# Altium schematic sheet handheld_circuits.SchDoc: DE:HANDHELD
size 139 x 96 mm; SheetNumber: 1; SheetTotal: 2; WebFGR: www.abebashop.com; VersionFGR: 20220726; PageSetup: Record=PageOptions|CenterHorizontal=True|CenterVertical=True|PrintScale=2.09|XCorrection=1.00|YCorrection=1.00|PrintKind=0|BorderSize=5000000|LeftOffset=0|BottomOffset=0|Orientation=2|PaperLength=1000|PaperWidth=1000|Scale=100|PaperSource=7|PrintQuality=-4|MediaType=1|DitherType=10|PaperKind=A4|PrintScaleMode=1
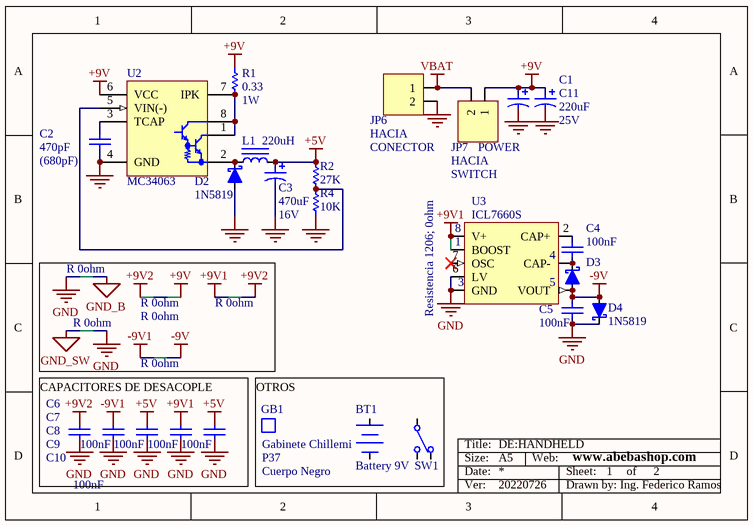
[diagram p0: handheld_circuits.SchDoc]

## Parts
BT1  Battery 9V  [BAT_9V]
C1  Cap Pol  [C_EL_8X11-5]  (value not drawn)
C2  value 470pF  Technology: (680pF)  [c1206]  (hidden comment: Cap)
C3  value 470uF  Voltaje: 16V  [C_EL_6-3X11]  (hidden comment: Cap Pol)
C4  value 100nF  [c1206]  (hidden comment: Cap)
C5  value 100nF  [c1206]  (hidden comment: Cap)
C6  value 100nF  [c1206]  (hidden comment: Cap)
C7  value 100nF  [c1206]  (hidden comment: Cap)
C8  value 100nF  [c1206]  (hidden comment: Cap)
C9  value 100nF  [c1206]  (hidden comment: Cap)
C10  value 100nF  [c1206]  (hidden comment: Cap)
C11  value 220uF  Voltaje: 25V  [C_EL_8X11-5]  (hidden comment: Cap Pol)
D2  1N5819  [d_do41]
D3  1N5819  [d_do41]  (value not drawn)
D4  1N5819  [d_do41]
GB1  Gabinete Chillemi  Codigo Chillemi: P37  Dolares Chillemi: Cuerpo Negro  [PLA_GAB_HAND_HALF]
JP6  HACIA  Price: CONECTOR  [CONPOL2X1]
JP7  Codigo Elemon: HACIA  Dolares Elemon: POWER  XXX: SWITCH  [CONPOL2X1]  (hidden comment: XY128V-A2P)
L1  value 220uH  [L_10X12]  (hidden comment: Inductor)
R1  Resistencia: 0.33  [RES300TH]  (hidden comment: Resistencia 1W; 100Kohm)
R2  Resistencia: 27K  [R1206]  (hidden comment: Resistencia 1206; 1Kohm)
R4  Resistencia: 10K  [R1206]  (hidden comment: Resistencia 1206; 1Kohm)
R15  Resistencia 1206; 0ohm  [R1206]
R16  R 0ohm  [R1206]
R19  R 0ohm  [R1206]
R21  R 0ohm  [R1206]
R25  R 0ohm  [R1206]
R26  R 0ohm  [R1206]
R28  R 0ohm  [R1206]
SW1  Tecla (sin pads)  [SW_TECLA_NO_PADS]  (value not drawn)
U2  MC34063  [dip8z]
U3  ICL7660S  [DIP8Z]

## Nets
+5V: C3.1 C8.2 C10.2 L1.2 R2.1
+9V: C1.1 C11.1 JP7.1 R1.2 R26.1 U2.6(VCC)
+9V1: C9.2 R15.2 R16.2 U3.8(V+)
+9V2: C6.2 R16.1 R25.2
-9V: C5.2 D3.1(A) D4.1(A) R28.1 U3.5(VOUT)
-9V1: C7.2 R28.2
GND: C1.2 C2.1 C3.2 C5.1 C6.1 C7.1 C8.1 C9.1 C10.1 C11.2 D2.1(A) D4.2(K) JP6.2 R4.1 R19.2 R21.1 U2.4(GND) U3.3(GND) U3.6(LV)
GND_B: R19.1
GND_SW: R21.2
VBAT: JP6.1 JP7.2
NetC2_2: C2.2 U2.3(TCAP)
NetC4_1: C4.1 D3.2(K) U3.4(CAP-)
NetC4_2: C4.2 U3.2(CAP+)
NetD2_2: D2.2(K) L1.1 U2.2(SWE)
NetR1_1: R1.1 U2.1(SWC) U2.7(IPK) U2.8(DRVC)
NetR2_2: R2.2 R4.2 U2.5(VIN(-))
NetR15_1: R15.1 U3.1(BOOST)
NetR25_1: R25.1 R26.2

Not connected (* = marked no-connect by the designer): U3 7(OSC)*

## Notes on the sheet
- CAPACITORES DE DESACOPLE
- OTROS
- Title:
- Size:
- Date:
- A5
- Web:
- Sheet:
- of
- Ver:
- Drawn by: Ing. Federico Ramos
- (in symbol Resistencia 1W; 100Kohm) 1W

## Library data of the parts
C1 = Cap Pol: Capacitor Polarizado; Value: 220uF; Voltaje: 25V; Price: ?
C2 C4-C10 = Cap: Capacitor; Voltage: 50V; Price: 0.25
  C4 C5: Technology: Ceramic
C3 C11 = Cap Pol: Capacitor Polarizado; Price: ?
D2-D4 = 1N5819: Schottky Diode 1A 40V; Revision: July-2002: Re-released for DXP Platform.
GB1 = Gabinete Chillemi P37; Cuerpo Negro
JP6 = Header2x1: Header 2x1
JP7 = Bornera Tornillos 2x1; Altura = 13.8mm
R1 = Resistencia 1W; 100Kohm: Codigo Elemon: RS4036305; Dolares Elemon: 0.06231
R2 R4 = Resistencia 1206; 1Kohm: Codigo Elemon: RS3886185; Dolares Elemon: 0.00720
R15 R16 R19 R21 R25 R26 R28 = Resistencia 1206; 0ohm: Codigo Elemon: RS3885900; Dolares Elemon: 0.00720
U2 = MC34063: DC-to-DC Converter Control Circuit
U3 = ICL7660S: Switched Capacitor Voltage Converter
BT1 = Battery 9V: Revision: July-2002: Re-released for DXP Platform.
L1 = Inductor: Revision: July-2002: Re-released for DXP Platform.
SW1 = Tecla (sin pads): Price: ?